# EAGLE design main-copy-cap-touch-ROUGH (EAGLE 8.5.0)
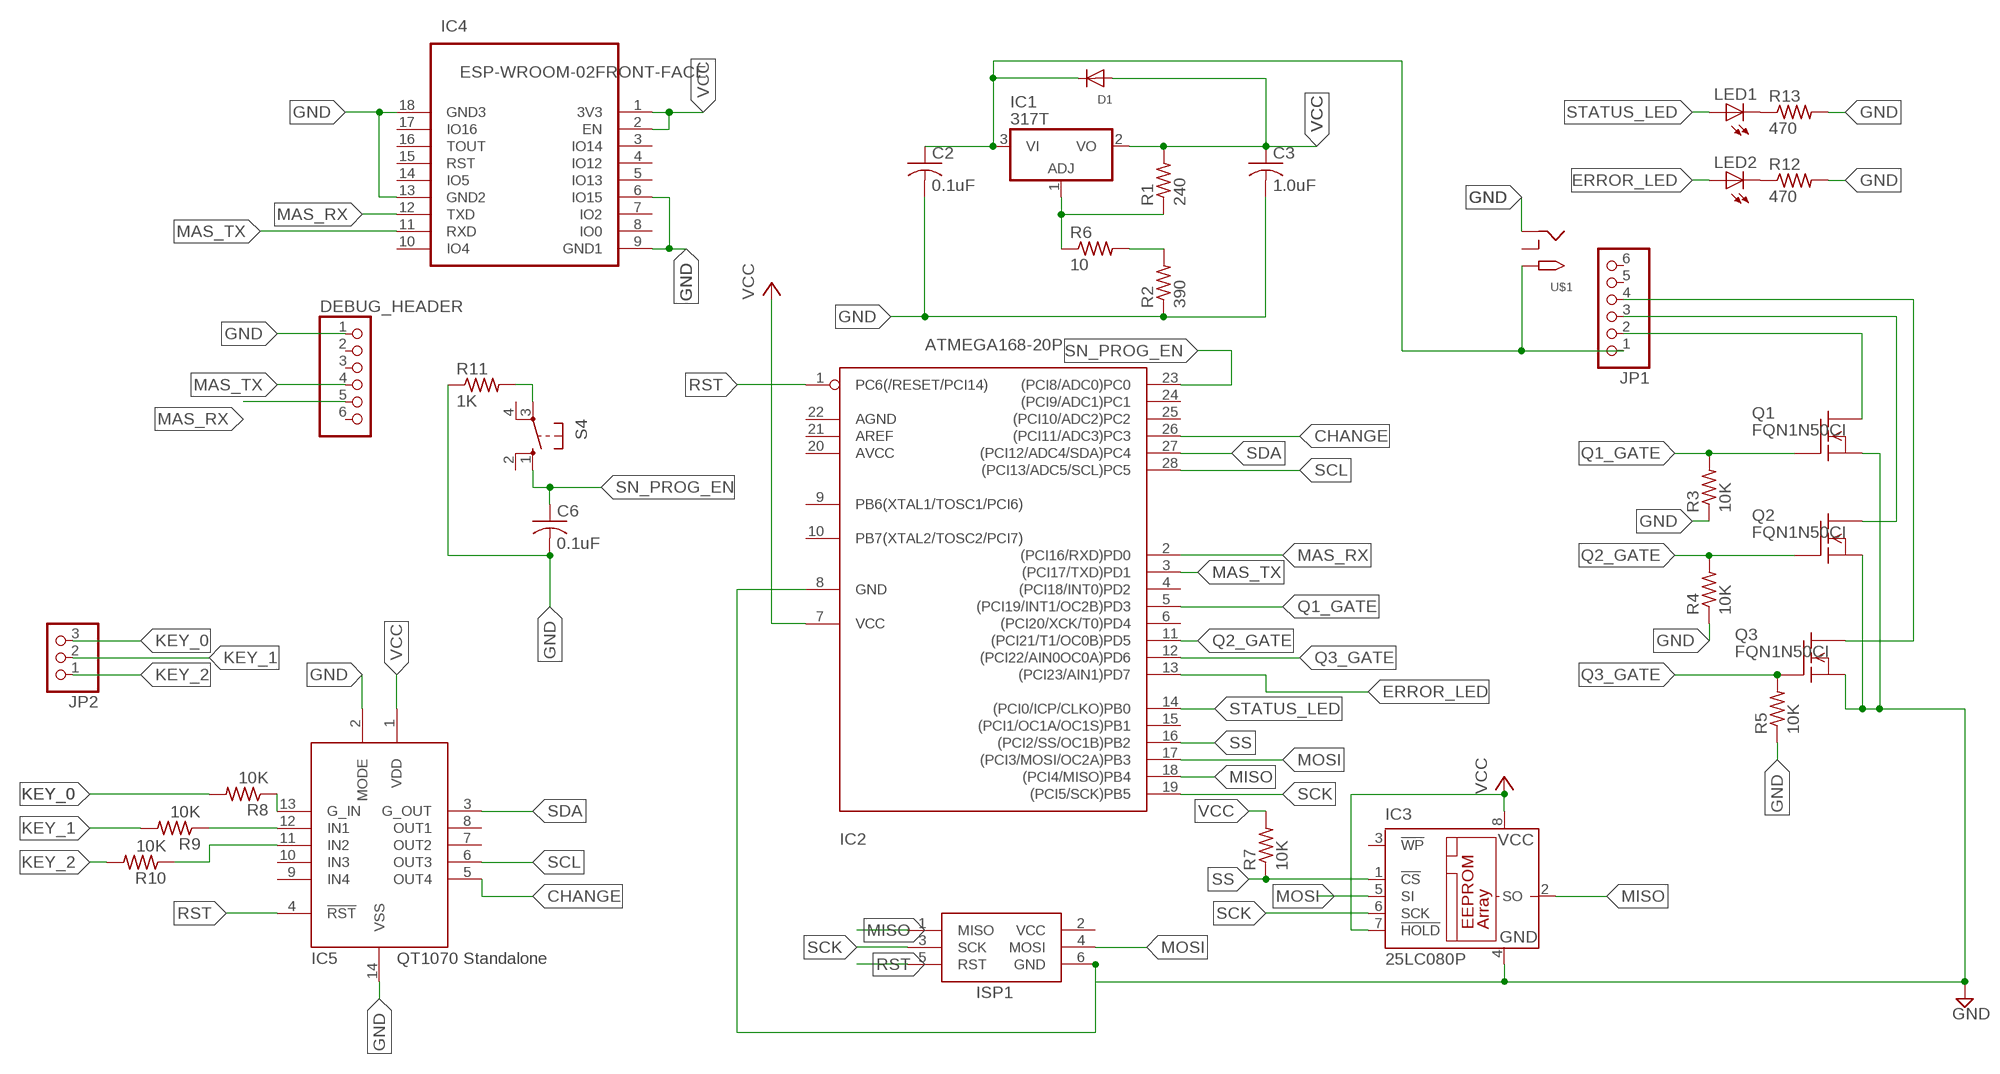
[diagram p0: schematic, sheet 1]

## Parts
C2  0.1uF  C-US025-030X050  [C025-030X050]
C3  1.0uF  C-US025-030X050  [C025-030X050]
C6  0.1uF  C-US025-030X050  [C025-030X050]
D1  DIODEDO-1N4148  [DO-1N4148]
DEBUG_HEADER  PINHD-1X6B  [1X06-BIG]
IC1  317T  [TO220H]
IC2  ATMEGA168-20P  [DIL28-3]
IC3  25LC080P  [DIL8]
IC4  ESP-WROOM-02FRONT-FACE  [FRONT-FACE]
IC5  AT42QT1070-SSU  [SO14]
ISP1  AVRISP-6  [AVRISP]
JP1  PINHD-1X6B  [1X06-BIG]
JP2  PINHD-1X3  [1X03]
LED1  LED5MM  [LED5MM]
LED2  LED5MM  [LED5MM]
Q1  FQN1N50CI  [TO92-INLINE]
Q2  FQN1N50CI  [TO92-INLINE]
Q3  FQN1N50CI  [TO92-INLINE]
R1  240  R-US_0204/7  [0204/7]
R2  390  R-US_0204/7  [0204/7]
R3  10K  R-US_0204/7  [0204/7]
R4  10K  R-US_0204/7  [0204/7]
R5  10K  R-US_0204/7  [0204/7]
R6  10  R-US_0204/7  [0204/7]
R7  10K  R-US_0204/7  [0204/7]
R8  10K  R-US_0204/7  [0204/7]
R9  10K  R-US_0204/7  [0204/7]
R10  10K  R-US_0204/7  [0204/7]
R11  1K  R-US_0204/7  [0204/7]
R12  470  R-US_0204/7  [0204/7]
R13  470  R-US_0204/7  [0204/7]
S4  10-XX  [B3F-10XX]
U$1  2.1MMJACKTHM  [PJ-102A]

## Nets
CHANGE: IC2.26((PCI11/ADC3)PC3) IC5.5(OUT4)
ERROR_LED: IC2.13((PCI23/AIN1)PD7) LED2.A
GND: C2.2 C3.2 C6.2 DEBUG_HEADER.1 IC2.8(GND) IC3.4(GND) IC4.6(IO15) IC4.9(GND1) IC4.13(GND2) IC4.18(GND3) IC5.2(MODE) IC5.14(VSS) ISP1.6(GND) Q1.3(S) Q2.3(S) Q3.3(S) R2.1 R3.1 R4.1 R5.1 R11.1 R12.2 R13.2 U$1.RING
KEY_0: JP2.3 R8.2
KEY_1: JP2.2 R9.2
KEY_2: JP2.1 R10.2
MAS_RX: DEBUG_HEADER.5 IC2.2((PCI16/RXD)PD0) IC4.12(TXD)
MAS_TX: DEBUG_HEADER.4 IC2.3((PCI17/TXD)PD1) IC4.11(RXD)
MISO: IC2.18((PCI4/MISO)PB4) IC3.2(SO) ISP1.1(MISO)
MOSI: IC2.17((PCI3/MOSI/OC2A)PB3) IC3.5(SI) ISP1.4(MOSI)
N$1: IC5.13(G_IN) R8.1
N$2: IC5.12(IN1) R9.1
N$3: IC5.11(IN2) R10.1
N$4: R2.2 R6.2
N$6: IC1.1(ADJ) R1.1 R6.1
N$8: JP1.2 Q1.1(D)
N$9: LED1.K(C) R13.1
N$10: LED2.K(C) R12.1
N$11: JP1.3 Q2.1(D)
N$13: JP1.4 Q3.1(D)
N$14: R11.2 S4.3(P)
Q1_GATE: IC2.5((PCI19/INT1/OC2B)PD3) Q1.2(G) R3.2
Q2_GATE: IC2.11((PCI21/T1/OC0B)PD5) Q2.2(G) R4.2
Q3_GATE: IC2.12((PCI22/AIN0OC0A)PD6) Q3.2(G) R5.2
RST: IC2.1(PC6(/RESET/PCI14)) IC5.4(!RST) ISP1.5(RST)
SCK: IC2.19((PCI5/SCK)PB5) IC3.6(SCK) ISP1.3(SCK)
SCL: IC2.28((PCI13/ADC5/SCL)PC5) IC5.6(OUT3)
SDA: IC2.27((PCI12/ADC4/SDA)PC4) IC5.3(G_OUT)
SN_PROG_EN: C6.1 IC2.23((PCI8/ADC0)PC0) S4.1(S)
SS: IC2.16((PCI2/SS/OC1B)PB2) IC3.1(!CS) R7.1
STATUS_LED: IC2.14((PCI0/ICP/CLKO)PB0) LED1.A
VCC: C3.1 D1.A IC1.2(VO) IC2.7(VCC) IC3.7(!HOLD) IC3.8(VCC) IC4.1(3V3) IC4.2(EN) IC5.1(VDD) R1.2 R7.2
VIN: C2.1 D1.C IC1.3(VI) JP1.1 U$1.TIP
Unconnected: DEBUG_HEADER.2 DEBUG_HEADER.3 DEBUG_HEADER.6 IC2.4((PCI18/INT0)PD2) IC2.6((PCI20/XCK/T0)PD4) IC2.9(PB6(XTAL1/TOSC1/PCI6)) IC2.10(PB7(XTAL2/TOSC2/PCI7)) IC2.15((PCI1/OC1A/OC1S)PB1) IC2.20(AVCC) IC2.21(AREF) IC2.22(AGND) IC2.24((PCI9/ADC1)PC1) IC2.25((PCI10/ADC2)PC2) IC3.3(!WP) IC4.3(IO14) IC4.4(IO12) IC4.5(IO13) IC4.7(IO2) IC4.8(IO0) IC4.10(IO4) IC4.14(IO5) IC4.15(RST) IC4.16(TOUT) IC4.17(IO16) IC5.7(OUT2) IC5.8(OUT1) IC5.9(IN4) IC5.10(IN3) JP1.5 JP1.6 S4.2(S1) S4.4(P1) U$1.RING_SW

## Power pins joined to a net without a drawn wire
VCC: ISP1.2(VCC)

## Library data of the parts
C2 C3 C6 = adafruit:C-US: CAPACITOR, American symbol
D1 = adafruit:DIODE: Diode SMADIODE - SMA Surface Mount Package 20V 1A Schottky Diode Digikey: 641-1014-6-ND DO-1N4148 - Through Hole Small Current Diode SOD-123 20V 1 A (.5mV Vf) Schottky Diode - Digikey: MBRX120TPMSCT-ND SOD-323 10V 570mA (.38mV Vf, 3ns) Schottky Diode - Digikey: ZLLS410CT-ND SOD-523 30V 30mA Schottky Diode (RB751S-40TE61) - Digikey: RB751S-40TE61CT-ND SOT23-R/W - SOT23 Package (R = Solder Paste/Reflow Ovens, W = Hand-Soldering) BAT54Film 40V 300mA - Digikey: 497-7162-1-ND
DEBUG_HEADER JP1 = adafruit:PINHD-1X6: PIN HEADER
IC1 = linear:*317: Positive VOLTAGE REGULATOR
IC2 = adafruit:ATMEGA168*P: MICROCONTROLLER 16 kBytes FLASH 1 kBytes SRAM 512 Bytes EEPROM USART 8-channel 10 bit ADC
IC3 = microchip:25*: Serial EEPROM 4K/ 8K , SPI bus; MF: MICROCHIP; MPN: 25LC080/P; OC_FARNELL: 1556143; OC_NEWARK: 92C7440
IC4 = esp-wroom-02:ESP-WROOM-02: WiFi module - ESP-WROOM-02
IC5 = adafruit:AT42QT1070: QTouch 5-channel standalone sensor IC AT42QT1070 in standalone mode has 5 inputs (guard + 4 key) and open drain outputs. 1.8V-5.5V power.
ISP1 = adafruit:AVRISP: AVR ISP HEADER Standard 6 pin header for AVR programming
JP2 = adafruit:PINHD-1X3: PIN HEADER
LED1 LED2 = adafruit:LED: LED OSRAM: - CHIPLED LG R971, LG N971, LY N971, LG Q971, LY Q971, LO R971, LY R971 LH N974, LH R974 LS Q976, LO Q976, LY Q976 LO Q996 - Hyper CHIPLED LW Q18S LB Q993, LB Q99A, LB R99A - SideLED LS A670, LO A670, LY A670, LG A670, LP A670 LB A673, LV A673, LT A673, LW A673 LH A674 LY A675 LS A676, LA A676, LO A676, LY A676, LW A676 LS A679, LY A679, LG A679 - Hyper Micro SIDELED® LS Y876, LA Y876, LO Y876, LY Y876 LT Y87S - SmartLED LW L88C, LW L88S LB L89C, LB L89S, LG L890 LS L89K, LO L89K, LY L89K LS L896, LA L896, LO L896, LY L896 - TOPLED LS T670, LO T670, LY T670, LG T670, LP T670 LSG T670, LSP T670, LSY T670, LOP T670, LYG T670 LG T671, LOG T671, LSG T671 LB T673, LV T673, LT T673, LW T673 LH T674 LS T676, LA T676, LO T676, LY T676, LB T676, LH T676, LSB T676, LW T676 LB T67C, LV T67C, LT T67C, LS T67K, LO T67K, LY T67K, LW E67C LS E67B, LA E67B, LO E67B, LY E67B, LB E67C, LV E67C, LT E67C LW T67C LS T679, LY T679, LG T679 LS T770, LO T770, LY T770, LG T770, LP T770 LB T773, LV T773, LT T773, LW T773 LH T774 LS E675, LA E675, LY E675, LS T675 LS T776, LA T776, LO T776, LY T776, LB T776 LHGB T686 LT T68C, LB T68C - Hyper Mini TOPLED® LB M676 - Mini TOPLED Santana® LG M470 LS M47K, LO M47K, LY M47K Source: http://www.osram.convergy.de/
Q1-Q3 = adafruit:FQN1N50C: N-Channel Enhancement MOSFET 500V, 0.4A, 6.0 Ohm
R1-R13 = adafruit:R-US_: RESISTOR, American symbol
S4 = switch-omron:10-XX: OMRON SWITCH; MPN: B3F-1000; OC_FARNELL: 176432; OC_NEWARK: 36M3542
U$1 = adafruit:2.1MMJACK: 2.1mm x 5.5mm THM DC jack with internal switch. Digikey part #PJ-102A, 4UCON part #05537 2.1mm x 5.5mm SMT DC jack with internal switch. Digikey part #PJ-002A-SMT, 4UCON part #03267 By microbuilder.eu & adafruit.com

## Board
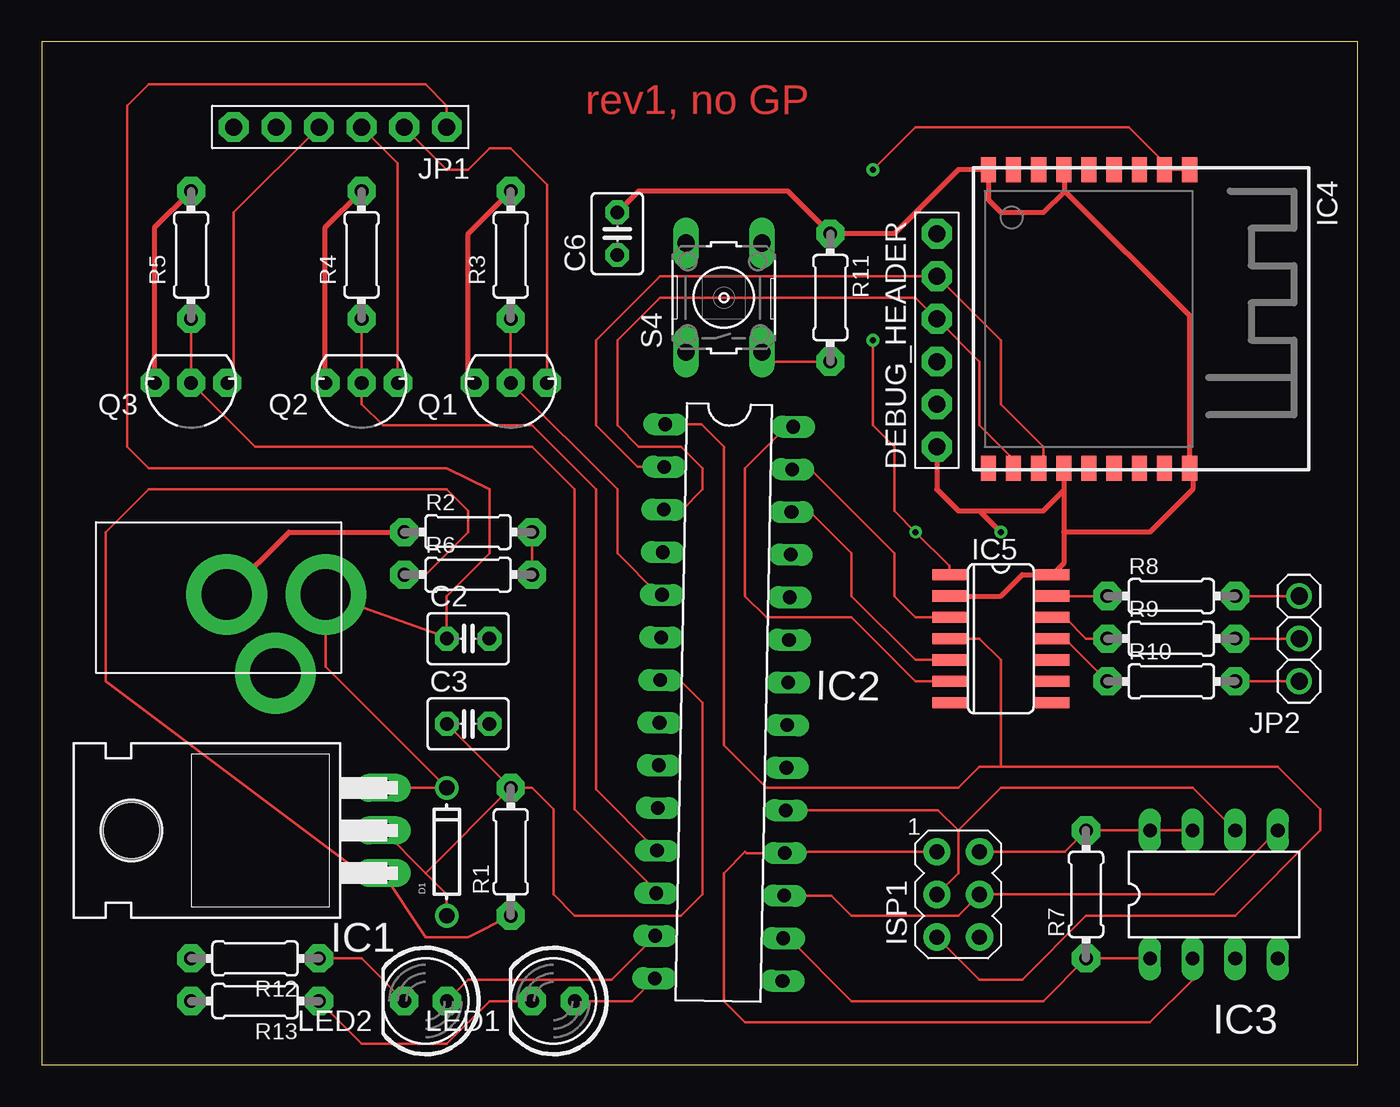
[diagram p1: board, top side]
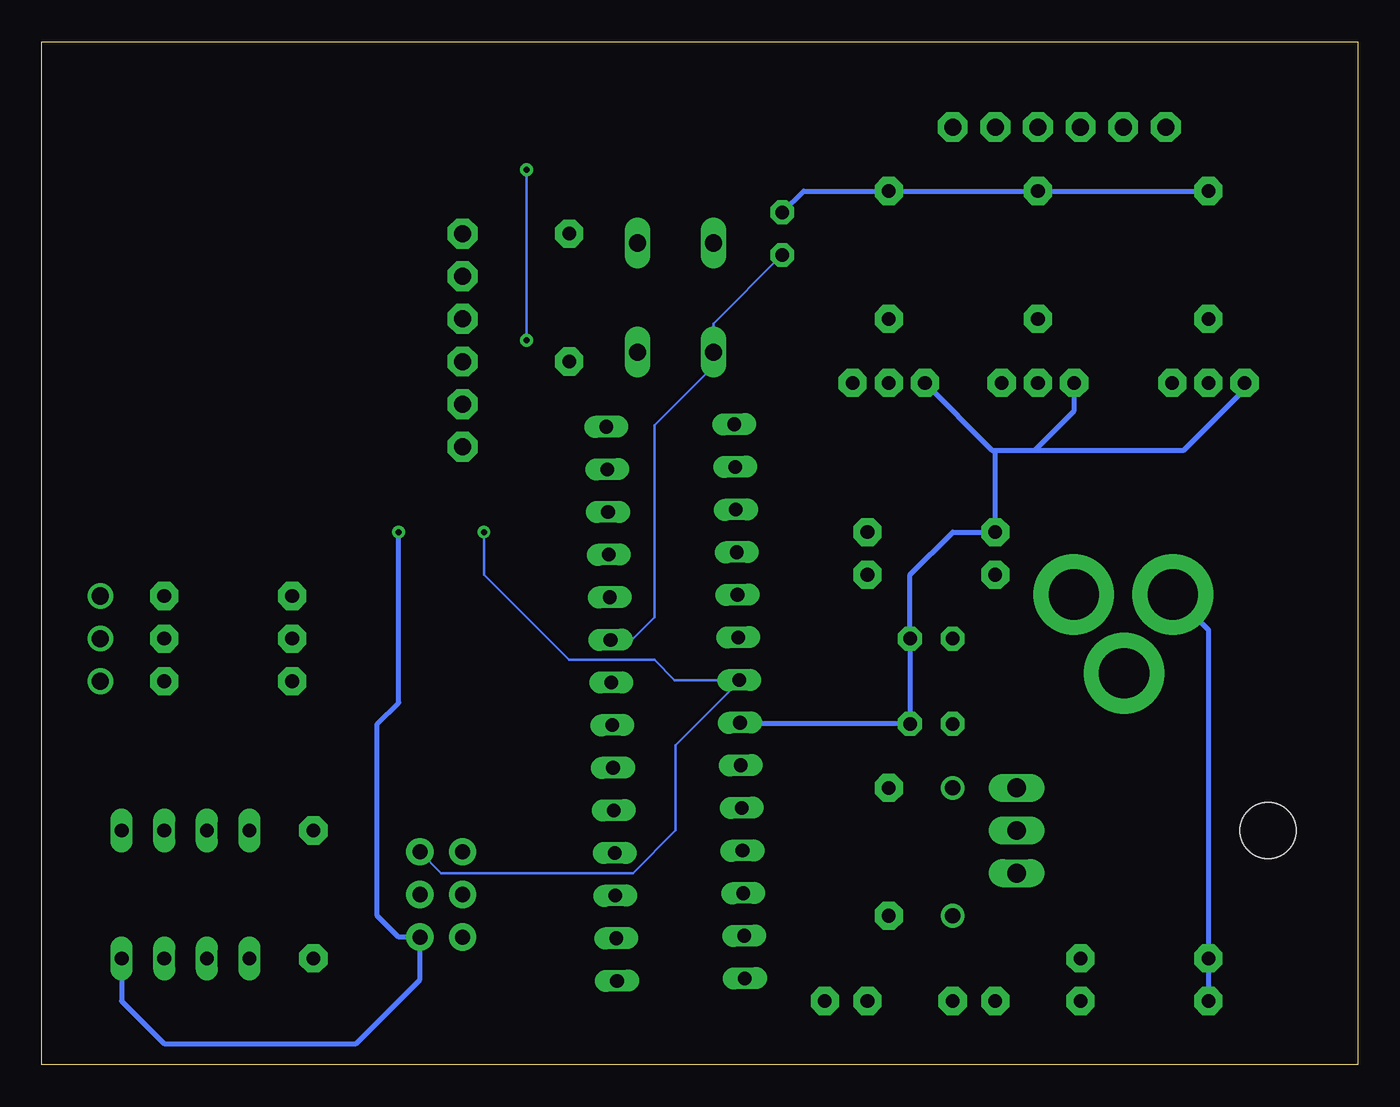
[diagram p2: board, bottom side, seen from below]

Size 78.41 x 60.95 mm. Coordinates in mm from the lower left corner, seen from the top.
Outline: 0,0 78.41,0 78.41,60.95 0,60.95 0,0
Copper layers (1*16): Top 0.035mm / dielectric 1.5mm / Bottom 0.035mm
Design rules "default": minimum track width 6mil, minimum drill 0.35mm, track to track 6mil, track to pad 6mil, pad to pad 6mil, via to via 6mil, smd to smd 6mil, copper to edge 40mil, drill to drill 6mil, minimum pad ring 10mil, minimum via ring 8mil, stop-mask expansion 4mil, vias tented up to drill 0mil, thermal gap 10mil

### Footprints (pad centres in the part's own frame; a part is rotated, then mirrored left to right if it is on the bottom)
C025-030X050 = drill 0.813 pad 1.422 octagon: 1 -1.27,0; 2 1.27,0
DO-1N4148 = drill 0.9: A -3.81,0; C 3.81,0
1X06-BIG = drill 1.016 pad 1.778 octagon: 1 -6.35,0; 2 -3.81,0; 3 -1.27,0; 4 1.27,0; 5 3.81,0; 6 6.35,0
TO220H = drill 1.118 long: 1 -2.54,-10.16; 2 0,-10.16; 3 2.54,-10.16 | hole 3.302: 0,4.826
DIL28-3 = drill 0.813 long: 1 -16.51,-3.81; 2 -13.97,-3.81; 3 -11.43,-3.81; 4 -8.89,-3.81; 5 -6.35,-3.81; 6 -3.81,-3.81; 7 -1.27,-3.81; 8 1.27,-3.81; 9 3.81,-3.81; 10 6.35,-3.81; 11 8.89,-3.81; 12 11.43,-3.81; 13 13.97,-3.81; 14 16.51,-3.81; 15 16.51,3.81; 16 13.97,3.81; 17 11.43,3.81; 18 8.89,3.81; 19 6.35,3.81; 20 3.81,3.81; 21 1.27,3.81; 22 -1.27,3.81; 23 -3.81,3.81; 24 -6.35,3.81; 25 -8.89,3.81; 26 -11.43,3.81; 27 -13.97,3.81; 28 -16.51,3.81
DIL8 = drill 0.813 long: 1 -3.81,-3.81; 2 -1.27,-3.81; 3 1.27,-3.81; 4 3.81,-3.81; 5 3.81,3.81; 6 1.27,3.81; 7 -1.27,3.81; 8 -3.81,3.81
FRONT-FACE = smd 1.485 x 0.9: 1 -8.893,4.9; 2 -8.893,3.4; 3 -8.893,1.9; 4 -8.893,0.4; 5 -8.893,-1.1; 6 -8.893,-2.6; 7 -8.893,-4.1; 8 -8.893,-5.6; 9 -8.893,-7.1; 10 8.893,-7.1; 11 8.893,-5.6; 12 8.893,-4.1; 13 8.893,-2.6; 14 8.893,-1.1; 15 8.893,0.4; 16 8.893,1.9; 17 8.893,3.4; 18 8.893,4.9
SO14 = smd 0.66 x 2.032: 1 -3.81,-3.073; 2 -2.54,-3.073; 3 -1.27,-3.073; 4 0,-3.073; 5 1.27,-3.073; 6 2.54,-3.073; 7 3.81,-3.073; 8 3.81,3.073; 9 2.54,3.073; 10 1.27,3.073; 11 0,3.073; 12 -1.27,3.073; 13 -2.54,3.073; 14 -3.81,3.073
AVRISP = drill 0.9 pad 1.626: 1 -1.27,2.54; 2 1.27,2.54; 3 -1.27,0; 4 1.27,0; 5 -1.27,-2.54; 6 1.27,-2.54
1X03 = drill 1.016: 1 -2.54,0; 2 0,0; 3 2.54,0
LED5MM = drill 0.813 pad 1.676 octagon: A -1.27,0; K 1.27,0
TO92-INLINE = drill 0.813 pad 1.676 octagon: 1 -2.159,0; 2 0,0; 3 2.159,0
0204/7 = drill 0.813 pad 1.676 octagon: 1 -3.81,0; 2 3.81,0
B3F-10XX = drill 1.016 long: 1 -3.251,2.261; 2 3.251,2.261; 3 -3.251,-2.261; 4 3.251,-2.261
PJ-102A = drill 3 pad 4.8: RING 0.1,-3.39; RING_SW -4.6,-6.29; TIP 0.1,-9.29

### Placement (x,y rotation side)
C2  25.4,25.4 0 top
C3  25.4,20.32 0 top
C6  34.29,49.53 90 top
D1  24.13,12.7 90 top
DEBUG_HEADER  53.34,43.18 90 top
IC1  10.16,13.97 90 top
IC2  40.64,21.59 268.9 top
IC3  69.85,10.16 0 top
IC4  63.5,44.45 270 top
IC5  57.15,25.4 270 top
ISP1  54.61,10.16 0 top
JP1  17.78,55.88 180 top
JP2  74.93,25.4 90 top
LED1  30.48,3.81 180 top
LED2  22.86,3.81 180 top
Q1  27.94,40.64 180 top
Q2  19.05,40.64 180 top
Q3  8.89,40.64 180 top
R1  27.94,12.7 90 top
R2  25.4,31.75 0 top
R3  27.94,48.26 270 top
R4  19.05,48.26 270 top
R5  8.89,48.26 270 top
R6  25.4,29.21 0 top
R7  62.23,10.16 90 top
R8  67.31,27.94 0 top
R9  67.31,25.4 0 top
R10  67.31,22.86 0 top
R11  46.99,45.72 270 top
R12  12.7,6.35 180 top
R13  12.7,3.81 180 top
S4  40.64,45.72 90 top
U$1  7.62,27.94 90 top

### Tracks (layer width: path | path; a pad name or v marks a point on that pad's centre or on a via)
CHANGE
  Top 0.152: IC5.5 52.07,24.13 48.26,27.94 48.26,30.48 45.8,32.94 IC2.26
ERROR_LED
  Top 0.152: IC2.13 33.95,5.08 25.4,5.08 LED2.A
GND  (via drill 0.35)
  Top 0.305: 60.96,52.07 59.69,50.8 57.15,50.8 56.4,51.55 IC4.9 54.61,53.34 50.8,49.53 R11.1 44.45,52.07 35.56,52.07 C6.2 | 60.96,52.07 60.96,53.28 IC4.6 | IC4.13 60.9,34.23 | 60.9,34.23 60.9,31.75 | 60.9,31.75 60.9,29.89 IC5.14 58.42,29.21 57.15,27.94 IC5.2 | DEBUG_HEADER.1 53.34,34.29 54.61,33.02 55.88,33.02 | 55.88,33.02 59.69,33.02 60.9,34.23 | 60.9,31.75 66.04,31.75 68.58,34.29 68.58,35.38 IC4.18 68.4,44.63 60.96,52.07 | v57.15,31.75 55.88,33.02 | Q1.3 25.4,41.02 25.4,49.53 R3.1 | Q3.3 6.73,49.91 R5.1 | U$1.RING 14.72,31.75 R2.1 | Q2.3 16.89,49.91 R4.1
  Bottom 0.305: IC3.4 73.66,3.81 71.12,1.27 59.69,1.27 55.88,5.08 ISP1.6 57.15,7.62 58.42,8.89 58.42,20.32 57.15,21.59 v57.15,31.75 | C6.2 33.02,52.07 R3.1 R4.1 R5.1 | IC2.8 36.73,20.32 C3.2 C2.2 26.67,29.21 24.13,31.75 R2.1 21.59,36.45 21.78,36.64 | U$1.RING 8.89,25.92 R12.2 R13.2 | 21.78,36.64 Q1.3 | 21.78,36.64 19.24,36.64 | Q2.3 16.89,38.99 19.24,36.64 | 19.24,36.64 10.35,36.64 6.73,40.26 Q3.3
KEY_0
  Top 0.152: R8.2 JP2.3
KEY_1
  Top 0.152: R9.2 JP2.2
KEY_2
  Top 0.152: R10.2 JP2.1
MAS_RX
  Top 0.152: IC4.12 59.69,35.85 59.69,36.83 57.15,39.37 57.15,43.18 DEBUG_HEADER.5 36.83,46.99 33.02,43.18 33.02,38.1 35.49,35.63 IC2.2
MAS_TX
  Top 0.152: IC4.11 57.9,36.08 55.88,38.1 55.88,41.91 DEBUG_HEADER.4 52.07,45.72 36.83,45.72 34.29,43.18 34.29,38.1 35.56,36.83 38.1,36.83 39.37,35.56 39.37,34.29 38.17,33.09 IC2.3
MISO
  Top 0.152: ISP1.1 44.35,12.7 IC2.18 41.98,12.63 41.91,12.7 40.64,11.43 40.64,3.81 41.91,2.54 66.04,2.54 68.58,5.08 IC3.2
MOSI
  Top 0.152: IC2.17 47.06,10.09 48.26,8.89 54.61,8.89 ISP1.4 69.85,10.16 IC3.5
N$1
  Top 0.152: R8.1 IC5.13
N$2
  Top 0.152: R9.1 62.23,25.4 60.96,26.67 IC5.12
N$3
  Top 0.152: R10.1 60.96,25.4 IC5.11
N$4
  Top 0.152: R2.2 R6.2
N$6
  Top 0.152: R6.1 22.86,29.21 25.4,31.75 25.4,33.02 24.13,34.29 6.35,34.29 3.81,31.75 3.81,22.86 19.05,11.43 IC1.1 22.86,7.62 25.4,7.62 R1.1
N$8
  Top 0.152: Q1.1 30.1,52.45 27.94,54.61 26.67,54.61 25.4,53.34 24.13,53.34 JP1.2
N$9
  Top 0.152: LED1.K 26.67,3.81 24.13,1.27 19.05,1.27 R13.1
N$10
  Top 0.152: LED2.K 19.05,6.35 R12.1
N$11
  Top 0.152: Q2.1 21.21,53.72 JP1.3
N$13
  Top 0.152: Q3.1 11.43,41.02 11.43,50.8 JP1.4
N$14
  Top 0.152: R11.2 43.46,41.91 S4.3
Q1_GATE
  Top 0.152: R3.2 Q1.2 34.29,34.29 34.29,30.48 36.76,28.01 IC2.5
Q2_GATE
  Top 0.152: R4.2 Q2.2 19.05,39.37 20.32,38.1 29.21,38.1 33.02,34.29 33.02,16.51 33.02,16.41 IC2.11
Q3_GATE
  Top 0.152: R5.2 Q3.2 12.7,36.83 29.21,36.83 31.75,34.29 31.75,15.24 36.61,10.38 IC2.12
RST
  Top 0.152: 57.15,17.78 73.66,17.78 76.2,15.24 76.2,13.97 71.12,8.89 62.23,8.89 58.42,5.08 55.88,5.08 ISP1.5 | 57.15,17.78 55.88,17.78 54.61,16.51 43.18,16.51 40.64,19.05 40.64,36.83 39.3,38.17 IC2.1 38.03,38.17 | IC5.4 55.88,25.4 57.15,24.13 57.15,17.78
SCK
  Top 0.152: ISP1.3 54.61,11.43 54.61,13.97 | 54.61,13.97 53.41,15.17 IC2.19 | IC3.6 68.58,16.51 57.15,16.51 54.61,13.97
SCL
  Top 0.152: IC2.28 44.37,38.02 41.91,35.56 41.91,27.94 43.18,26.67 48.26,26.67 52.07,22.86 IC5.6
SDA
  Top 0.152: IC5.3 52.07,26.67 50.8,27.94 50.8,30.48 45.8,35.48 IC2.27
SN_PROG_EN
  Bottom 0.152: IC2.23 43.25,25.33 41.91,26.67 41.91,38.1 38.38,41.63 38.38,41.91 S4.1 38.38,44.17 C6.1
SS
  Top 0.152: IC3.1 R7.1 59.69,3.81 48.26,3.81 44.52,7.55 IC2.16 44.25,7.62
STATUS_LED
  Top 0.152: IC2.14 35.17,3.81 LED1.A
VCC  (via drill 0.35)
  Top 0.152: IC1.2 22.86,11.43 | 22.86,11.43 24.13,10.16 D1.A | R1.2 22.86,11.43 | C3.1 R1.2 | IC3.7 IC3.8 R7.2 60.96,12.7 ISP1.2 | R1.2 29.21,16.51 30.48,15.24 30.48,10.16 31.75,8.89 38.1,8.89 39.37,10.16 39.37,21.59 38.03,22.93 IC2.7 | IC5.1 54.08,29.74 v52.07,31.75 50.8,33.02 50.8,36.83 49.53,38.1 v49.53,43.18 | v49.53,53.34 52.07,55.88 64.77,55.88 67.31,53.34 | 67.31,53.34 IC4.1 | IC4.2 67.31,53.34
  Bottom 0.152: ISP1.2 54.61,11.43 43.18,11.43 40.64,13.97 40.64,19.05 36.86,22.83 IC2.7 40.71,22.93 41.91,24.13 46.99,24.13 52.07,29.21 v52.07,31.75 | v49.53,43.18 v49.53,53.34
VIN
  Top 0.152: IC1.3 D1.C 16.91,23.73 U$1.TIP 24.03,25.5 C2.1 24.13,27.94 26.67,30.48 26.67,34.29 24.13,35.56 6.35,35.56 5.08,36.83 5.08,57.15 6.35,58.42 22.86,58.42 24.13,57.15 JP1.1

### Text on the board
Top: rev1, no GP
tDocu: R Melpignano